# Altium project Serial Power Supply.PrjPcb (part 1 of 2)
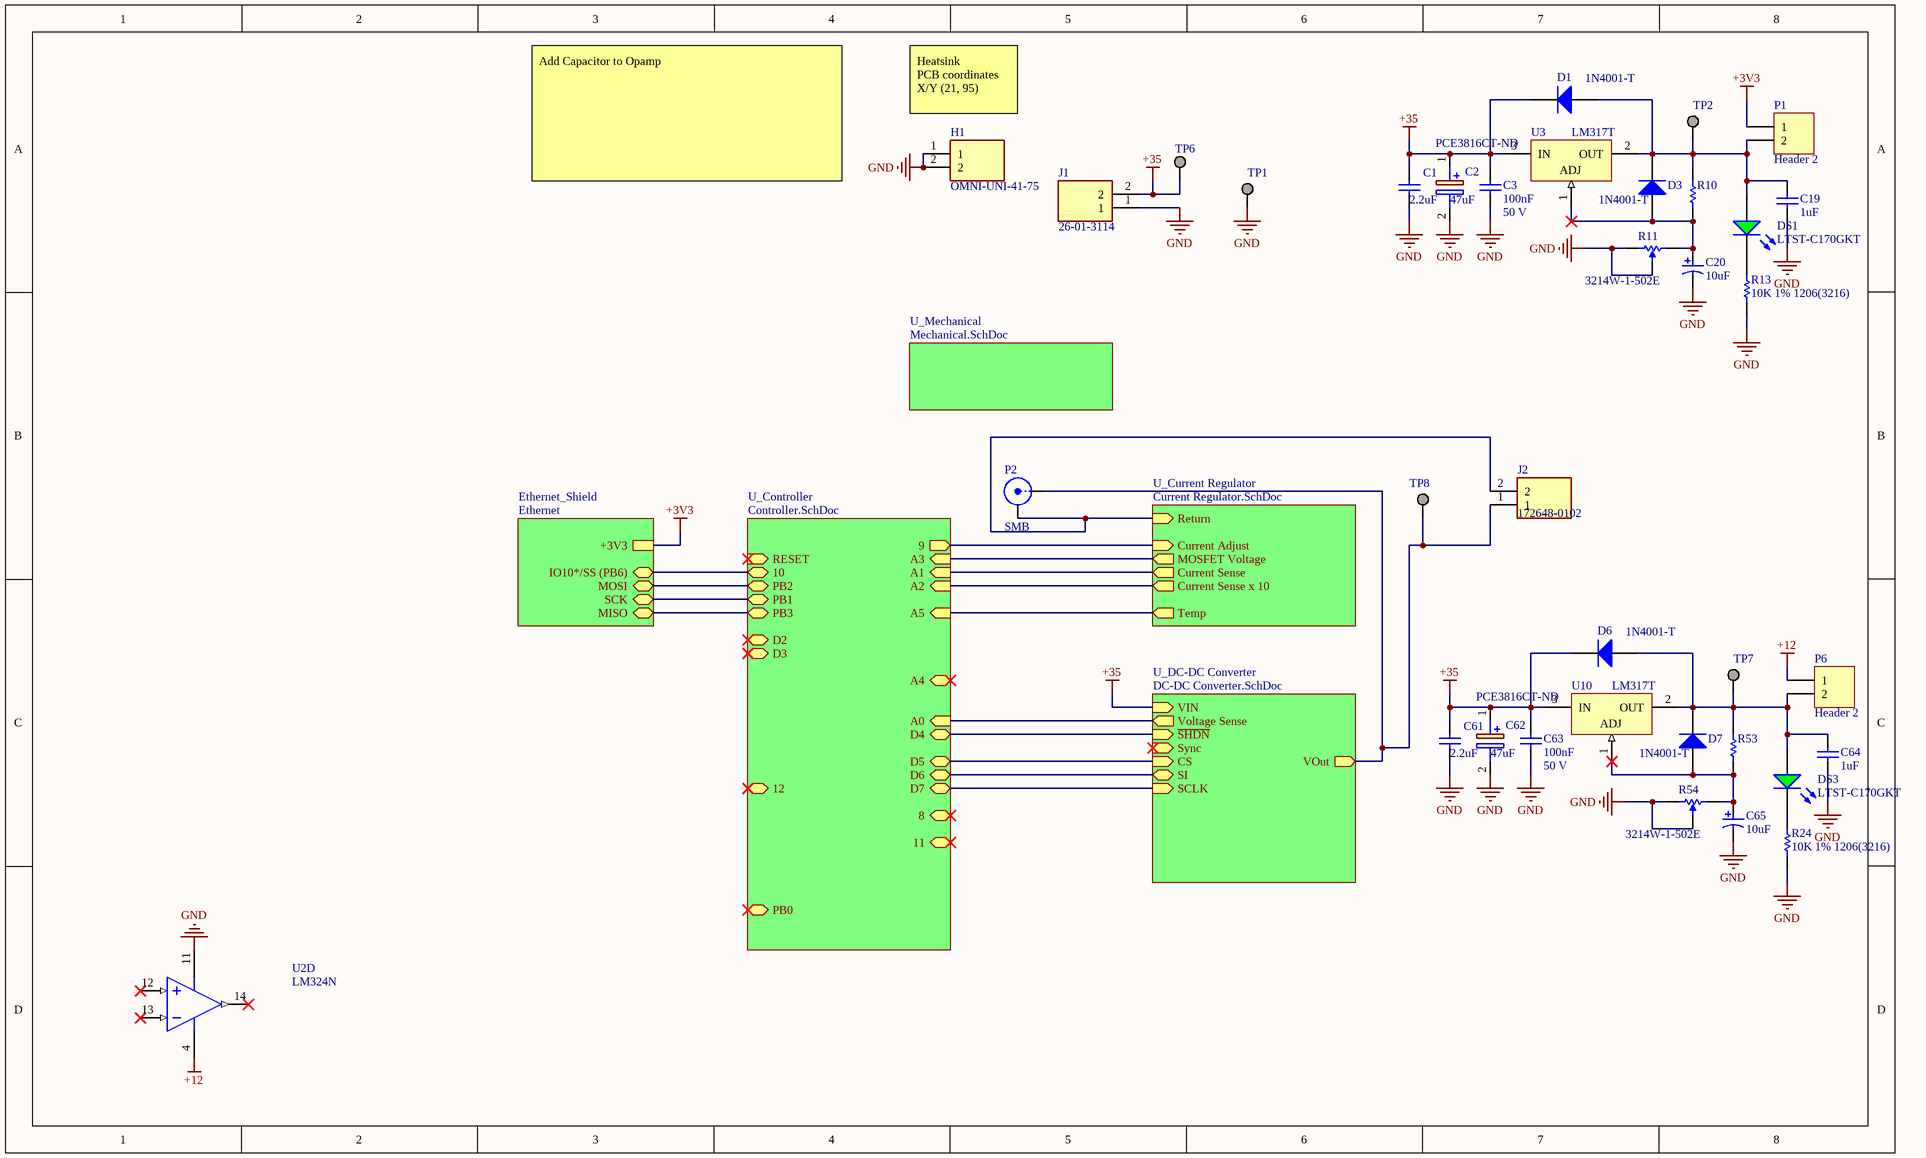
[diagram p0: Serial Power Supply - Main.SchDoc]
CERNProject: CERNProject; EDHNumber: EDHNumber; Group: PH-ADE-ID; ProjectAddress1: CH-1211 Genève 23 - Switzerland; ProjectOrganization: European Organization for Nuclear Research; ProjectTitle: ProjectTitle
6 sheets, 185 parts. Net scope: hierarchical (ports join the sheet entries above them; power ports are global).
Board file: Serial Power Supply.PcbDoc
Sheets:
  Serial Power Supply - Main.SchDoc
    U_DC-DC Converter = DC-DC Converter.SchDoc
    U_Controller = Controller.SchDoc
    U_Current Regulator = Current Regulator.SchDoc
    U_Mechanical = Mechanical.SchDoc
    Ethernet_Shield = Ethernet.SchDoc

## Sheet Serial Power Supply - Main.SchDoc
size Legal

### Parts
C1  value 2.2uF  [CAPC1812(4532)280_L]  (hidden comment: CAP 2.2uF 100V 1812(4532))
C2  47uF  Supplier Part Number 1: PCE3816CT-ND  [CAPAE660X800N]
C3  value 100nF  Rated Voltage: 50 V  [CAPC1206(3216)100_L]  (hidden comment: CAP 100nF 50V 1206(3216))
C19  1uF  [CAPC3216X180X55LL15T30]
C20  10uF  [PNSC-FK-V-D_V]
C61  value 2.2uF  [CAPC1812(4532)280_L]  (hidden comment: CAP 2.2uF 100V 1812(4532))
C62  47uF  Supplier Part Number 1: PCE3816CT-ND  [CAPAE660X800N]
C63  value 100nF  Rated Voltage: 50 V  [CAPC1206(3216)100_L]  (hidden comment: CAP 100nF 50V 1206(3216))
C64  1uF  [CAPC3216X180X55LL15T30]
C65  10uF  [PNSC-FK-V-D_V]
D1  1N4001-T  [DIOD-DO-41-P-2_V]
D3  1N4001-T  [DIOD-DO-41-P-2_V]
D6  1N4001-T  [DIOD-DO-41-P-2_V]
D7  1N4001-T  [DIOD-DO-41-P-2_V]
DS1  LTST-C170GKT  [LTST-C170GKT_V]
DS3  LTST-C170GKT  [LTST-C170GKT_V]
H1  OMNI-UNI-41-75  [OMNIUNI4175]
J1  26-01-3114  [0026013114]
J2  172648-0102  [1726480102]
P1  Header 2  [HDR1X2]
P2  SMB  [SMB_V-RJ45]
P6  Header 2  [HDR1X2]
R10  ERA8AEB471V  [RESC3216X70X50LL20T25]  (value not drawn)
R11  3214W-1-502E  [BOUR-3214W_V]
R13  10K 1% 1206(3216)  [RESC1206(3216)_L]
R24  10K 1% 1206(3216)  [RESC1206(3216)_L]
R53  ERA8AEB471V  [RESC3216X70X50LL20T25]  (value not drawn)
R54  3214W-1-502E  [BOUR-3214W_V]
TP1  GND  [KSTN-1502-2]  (value not drawn)
TP2  3V3  [KSTN-1502-2]  (value not drawn)
TP6  +20V  [KSTN-1502-2]  (value not drawn)
TP7  12V  [KSTN-1502-2]  (value not drawn)
TP8  +20V  [KSTN-1502-2]  (value not drawn)
U2  LM324N  [N14A]  (part D of 4)
U3  LM317T  [TO-220]
U10  LM317T  [TO-220]

### Sub-sheets
Ethernet_Shield = Ethernet: +3V3, IO10*/SS (PB6) (bidir), MOSI (bidir), SCK (bidir), MISO (bidir)
U_Controller = Controller.SchDoc: PB3 (bidir), PB2 (bidir), PB1 (bidir), PB0 (bidir), RESET (in), D2 (bidir), A0 (in), 9 (out), D4 (bidir), A5 (in), 10 (bidir), A1 (in), D6 (bidir), A3 (in), A2 (in), 11 (bidir), 8 (bidir), 12 (bidir), D3 (bidir), A4 (bidir), D7 (bidir), D5 (bidir)
U_Current Regulator = Current Regulator.SchDoc: Return (in), Current Adjust (in), Current Sense x 10 (out), Current Sense (out), MOSFET Voltage (out), Temp (out)
U_DC-DC Converter = DC-DC Converter.SchDoc: Sync (in), VIN (in), ~{SHDN} (in), VOut (out), CS (in), Voltage Sense (out), SCLK (in), SI (bidir)
U_Mechanical = Mechanical.SchDoc: no entries

### Nets
+3V3: P1.1 ; sheet Ethernet_Shield/+3V3
+12: P6.1 U2.4(V+)
+35: C1.2 C2.1(+) C3.1 C61.2 C62.1(+) C63.1 D1.2(K) D6.2(K) J1.2 TP6.1 U3.3(IN) U10.3(IN) ; sheet U_DC-DC Converter/VIN
GND: C1.1 C2.2(-) C3.2 C19.1 C20.2 C61.1 C62.2(-) C63.2 C64.1 C65.2 H1.1 H1.2 J1.1 R11.1 R11.2 R13.1 R24.1 R54.1 R54.2 TP1.1 U2.11(GND)
9: sheet U_Controller/9, sheet U_Current Regulator/Current Adjust
10: sheet U_Controller/10, sheet Ethernet_Shield/IO10*/SS (PB6)
A0: sheet U_DC-DC Converter/Voltage Sense, sheet U_Controller/A0
A1: sheet U_Controller/A1, sheet U_Current Regulator/Current Sense
A2: sheet U_Controller/A2, sheet U_Current Regulator/Current Sense x 10
A3: sheet U_Controller/A3, sheet U_Current Regulator/MOSFET Voltage
A5: sheet U_Controller/A5, sheet U_Current Regulator/Temp
CS: sheet U_DC-DC Converter/CS, sheet U_Controller/D5
D4: sheet U_DC-DC Converter/~{SHDN}, sheet U_Controller/D4
D6: sheet U_DC-DC Converter/SI, sheet U_Controller/D6
D7: sheet U_DC-DC Converter/SCLK, sheet U_Controller/D7
MISO: sheet U_Controller/PB3, sheet Ethernet_Shield/MISO
MOSI: sheet U_Controller/PB2, sheet Ethernet_Shield/MOSI
PB1: sheet U_Controller/PB1, sheet Ethernet_Shield/SCK
Return: J2.2 P2.2(Y) ; sheet U_Current Regulator/Return
VOut: J2.1 P2.1(X) TP8.1 ; sheet U_DC-DC Converter/VOut
NetC19_2: C19.2 D1.1(A) D3.2(K) DS1.1(A) P1.2 R10.2 TP2.1 U3.2(OUT)
NetC20_1: C20.1 D3.1(A) R10.1 R11.3 U3.1(ADJ)
NetC64_2: C64.2 D6.1(A) D7.2(K) DS3.1(A) P6.2 R53.2 TP7.1 U10.2(OUT)
NetC65_1: C65.1 D7.1(A) R53.1 R54.3 U10.1(ADJ)
NetDS1_2: DS1.2(K) R13.2
NetDS3_2: DS3.2(K) R24.2

Not connected (* = marked no-connect by the designer): U2 12(IN4+)* 13(IN4-)* 14(OUT4)*

### Notes on the sheet
- (near H1) Heatsink
  PCB coordinates X/Y (21, 95)
- Add Capacitor to Opamp
- Title
- Size:
- Date:
- Legal
- Number:
- Time:
- Revision:
- Sheet
- of
- File:

### Library data of the parts
C1 C61 = CMP-1040-01635-1: CAP 2.2uF 100V ±10% 1812 (4532 Metric) Thickness 2.8mm SMD; Case-Metric: 4532; Case-EIA: 1812; Tolerance: Â±10%; Rated Voltage: 100 V; Max Thickness: 2.8 mm; Technology: SMT; Supplier 1: Digi-Key; Supplier Part Number 1: 445-4510-2-ND
C2 C62 = EEE-FK1H470XP: Capacitor Polarised / 47uF 50V / EEE-FK1H470XP; Manufacturer_Name: Panasonic; Allied_Number: 70258115; Datasheet Link: https://industrial.panasonic.com/cdbs/www-data/pdf/RDE0000/ABA0000C1181.pdf; Height: 8mm; Manufacturer_Part_Number: EEE-FK1H470XP; Mouser Part Number: 667-EEE-FK1H470XP; Mouser Price/Stock: https://www.mouser.co.uk/ProductDetail/Panasonic/EEE-FK1H470XP?qs=qE6bgDGEOCtuVppQsylaxg%3D%3D; Allied Price/Stock: https://www.alliedelec.com/panasonic-eee-fk1h470xp/70258115/; Supplier 1: Digi-Key
C3 C63 = CMP-1037-04202-1: CAP 100nF 50V ±10% 1206 (3216 Metric) Thickness 1mm SMD; Case-Metric: 3216; Tolerance: Â±10%; Case-EIA: 1206; Technology: SMT; Max Thickness: 1 mm
C19 C64 = CMP-2000-06418-1: Chip Capacitor, 1 uF, +/- 10%, 100 V, -55 to 125 degC, 1206 (3216 Metric), RoHS, Tape and Reel / HMK316B7105KL-T; PCN Part Number: X5R,X7RDielectrics23/Jan/2008; Manufacturer: Taiyo Yuden; Other Names: 587-1777-1; Online Catalog: MSeries; Kits: 587-1794-KIT-ND-KITCAPCERAMICHICAPMLCCSMD; Temperature Coefficient: X7R; Voltage - Rated: 100V; Catalog Drawings: xMKSeries_1206_1.6; Capacitance: 1µF; Standard Package: 1; Manufacturer URL: http://www.t-yuden.com/; Mounting Technology: SurfaceMount; Height - Seated (Max): -; Lead Style: -; Mounting Type: SurfaceMount,MLCC; Thickness (Max): 0.071"(1.80mm); Applications: GeneralPurpose; Lead Spacing: -; Operating Temperature: -55°C~125°C; Size / Dimension: 0.126"Lx0.063"W(3.20mmx1.60mm); Features: HighVoltage; Ratings: -; Category: Capacitors; Datasheet Version: 09/2015; Package Description: 2-Pin Surface Mount Device, Body 3.2 x1.6 mm; Tolerance: ±10%; Family: CeramicCapacitors; Package Reference: 1206; Packaging: CutTape(CT); Datasheet URL: http://www.yuden.co.jp/productdata/catalog/en/mlcc_all_e.pdf; Package / Case: 1206(3216Metric); Series: M
C20 C65 = CMP-2000-06207-1: Aluminum Electrolytic Capacitor, 10 uF, +/- 20%, 50 V, 2-Pin SMD (Size Code D), -55 to 105 degC, RoHS, Tape and Reel / EEEFK1H100P; Manufacturer: Panasonic; Lifetime@Temperature: 2000Hrs@105°C; Type: Can; Rated Voltage: 50V; Ripple Current: 165mA; Impedance: 0.88O; Capacitance: 10µF; Manufacturer URL: http://www.panasonic.com/; Mounting Technology: SurfaceMount; Datasheet URL: http://industrial.panasonic.com/cdbs/www-data/pdf/RDE0000/ABA0000C1181.pdf; Package Reference: FK-V-D; Series: FK; Operating Temp Range: -55to+105°C; Operating Temp-Max: 105°C; Datasheet Version: 03/2016; Package URL: http://industrial.panasonic.com/cdbs/www-data/pdf/RDE0000/DME0000COL48.pdf; Case Size/Dimension: Ø6.3x5.8mm; Package Description: 2-Pin Electrolytic Aluminum Capacitor, Body 6.6 x 6.6 mm
D1 D3 D6 D7 = CMP-0639-00006-2: 1.0 A Rectifier, 15 pF, 50 V, -65 to 150 degC, 2-Pin DO-41 Plastic, RoHS, Tape and Reel; Manufacturer: Diodes Inc; VF (V): 1; CT (pF): 15; Max. IR (uA): 5; VRRM (V): 50; Max. IFSM (A): 30; RoHS: TRUE; Mounting Technology: Through Hole; PartNumber: 1N4001-T; ComponentLink2Description: Datasheet; DatasheetVersion: Rev. 8-2; Operating Temperature Range (degC): -65 to 150; Packing: Tape and Reel; PackageReference: DO-41-P-2; ComponentLink1URL: http://diodes.com/; PackageDescription: 2-Pin Axial Lead, Body 4.635 x 2.36 mm, Lead Spread 25.4 mm; ComponentLink2URL: http://diodes.com/datasheets/ds28002.pdf; Max. Average Rectified Current IO (A): 1; ComponentLink1Description: Manufacturer URL
DS1 DS3 = CMP-1674-00002-5: LED Uni-Color Green, 100 mW, 120 mA, -55 to 85 degC, 2-Pin SMD, RoHS, Tape and Reel; Manufacturer: Lite-On; ComponentLink1URL: http://www.us.liteon.com/; Height: 1.1 mm; PackageDescription: 2-Pin Surface Mount Device, Body 2 x 1.25 mm; RoHSCompliant: true; Package Quantity: 1; Packaging: Tape and Reel; Mount: Surface Mount; Min Operating Temperature: -55 degC; DatasheetVersion: 03/2003; Max Operating Temperature: 85 degC; ComponentLink1Description: Manufacturer URL; Pins: 2; Mounting Technology: Surface Mount; Length: 2 mm; Colour: Green; PackageReference: C170GKT; ComponentLink2URL: http://media.digikey.com/pdf/Data%20Sheets/Lite-On%20PDFs/LTST-C170GKT.pdf; ComponentLink2Description: Datasheet
H1 = OMNI-UNI-41-75: Hardware; Manufacturer_Name: Wakefield-Vette; Datasheet Link: https://componentsearchengine.com/Datasheets/1/OMNI-UNI-41-75.pdf; Height: 63mm; Manufacturer_Part_Number: OMNI-UNI-41-75; Mouser Part Number: 567-OMNI-UNI-41-75; Mouser Price/Stock: https://www.mouser.co.uk/ProductDetail/Wakefield-Vette/OMNI-UNI-41-75?qs=u4fy%2FsgLU9MMQhJzv7kr6g%3D%3D
J1 = 26-01-3114: Connector; Manufacturer_Name: Molex; Datasheet Link: http://www.molex.com/webdocs/datasheets/pdf/en-us//0026013114_PCB_HEADERS.pdf; Height: 9mm; Manufacturer_Part_Number: 26-01-3114; Arrow Part Number: 26-01-3114; Mouser Part Number: 538-26-01-3114; Mouser Price/Stock: https://www.mouser.co.uk/ProductDetail/Molex/26-01-3114?qs=ZhwKFWhxrSEC8%252Bv2mQsO9A%3D%3D
J2 = 172648-0102: Connector; Manufacturer_Name: Molex; Datasheet Link: https://www.molex.com/pdm_docs/sd/1726480102_sd.pdf; Height: 5.4mm; Manufacturer_Part_Number: 172648-0102; Arrow Part Number: 172648-0102; Mouser Part Number: 538-172648-0102; Mouser Price/Stock: https://www.mouser.co.uk/ProductDetail/Molex/172648-0102?qs=OAhjpuo3Vu6rwl2O%2FXoypw%3D%3D
P1 P6 = Header 2: Header, 2-Pin; LatestRevisionDate: 17-Jul-2002; LatestRevisionNote: Re-released for DXP Platform.; Publisher: Altium Limited
P2 = SMB: SMB Straight Connector; LatestRevisionDate: 17-Jul-2002; LatestRevisionNote: Re-released for DXP Platform.; Publisher: Altium Limited
R10 R53 = CMP-2003-04470-1: 470 ohm; Manufacturer: Panasonic; Part Number: ERA8AEB471V
R11 R54 = CMP-2000-05579-1: 3214 - 5-Turn Trimpot(R) Trimming Potentiometer, 5 KOhm, +/- 10%, 0.25 W, -65 to 150 degC, RoHS, Tape and Reel; Manufacturer: Bourns; Temperature Coefficient: ±100ppm/°C; Power Rating: 250mW; No. of Turns: 5; Track Resistance: 5kohm; SVHC: NoSVHC(16-Jun-2014); Potentiometer Mounting: SMD; Manufacturer URL: http://www.bourns.com/; Resistance Tolerance: ±10%; Datasheet URL: http://www.bourns.com/docs/Product-Datasheets/3214.pdf; ROHS COMPLIANT: Yes; Mounting Technology: SurfaceMount; Datasheet Version: 05/2016; Package Reference: 3214W; Package Description: 3-Pin Surface Mount Device, Body 3.5 x 4.8 mm, Pitch 1.25 mm
R13 R24 = CMP-1014-00623-1: 10K 0.25W 1% 1206 (3216 Metric)  SMD; Case-Metric: 3216; Value: 10000.00 Ohm; Case-EIA: 1206; Power: 0.25 W; Technology: SMT; Tolerance: 1 %
TP1 TP2 TP6-TP8 = CMP-1672-00001-4: Terminal DBL Turret, Through Hole, RoHS; Contact Finish: Tin; Lead Pitch: 0.218 inch; PackageReference: 1502-2; Mount: Through Hole; Pins: 50; DatasheetVersion: Rev. A, 02/2008; RoHSCompliant: true; REACH SVHC: No SVHC; Contact Material: Brass; Length: 2.77 mm; PackageDescription: 1-Pin Through Hole Device, Dia 3.18 mm; Package Quantity: 1; Mounting Technology: Through Hole; Supplier 1: Mouser; Supplier Part Number 1: 575-2501200800000
U2 = CMP-0055-00082-1: Low Power Quad Operational Amplifier, 14-pin MDIP; Manufacturer: National Semiconductor; PackageTopMarking: NSUZXYYTTE#*LM324N; PowerWise: N; CompType: Amplifiers; PinCount: 14; PackageVersion: revG, May-2006; PackageReference: N14A; Code_JEDEC: MS-001-AA; PackageDescription: MDIP, .750 x .250 x.130in, 14 Lead, .100in Pitch; RoHS: N; DatasheetVersion: Aug-2000
U3 U10 = CMP-0244-00444-1: 1.5A, 1.2V to 37V Adjustable Voltage Regulator, 3-Pin TO-220; PackageVersion: 2011; ComponentLink1URL: http://www.st.com; ComponentLink2URL: http://www.st.com/internet/com/TECHNICAL_RESOURCES/TECHNICAL_LITERATURE/DATASHEET/CD00000455.pdf; PackageDescription: TO, Thru-Hole, Vertical, Heatsink Mounted; 3 In-Line Leads; Pitch 2.54 mm; PackageReference: TO-220; ComponentLink1Description: Manufacturer URL; ComponentLink3URL: http://www.st.com/internet/com/TECHNICAL_RESOURCES/TECHNICAL_LITERATURE/PACKAGE_INFORMATION/CD00004649.pdf; DatasheetVersion: 1/11/2011; ComponentLink2Description: Datasheet; ComponentLink3Description: Package Specification

## Sheet DC-DC Converter.SchDoc
size Legal
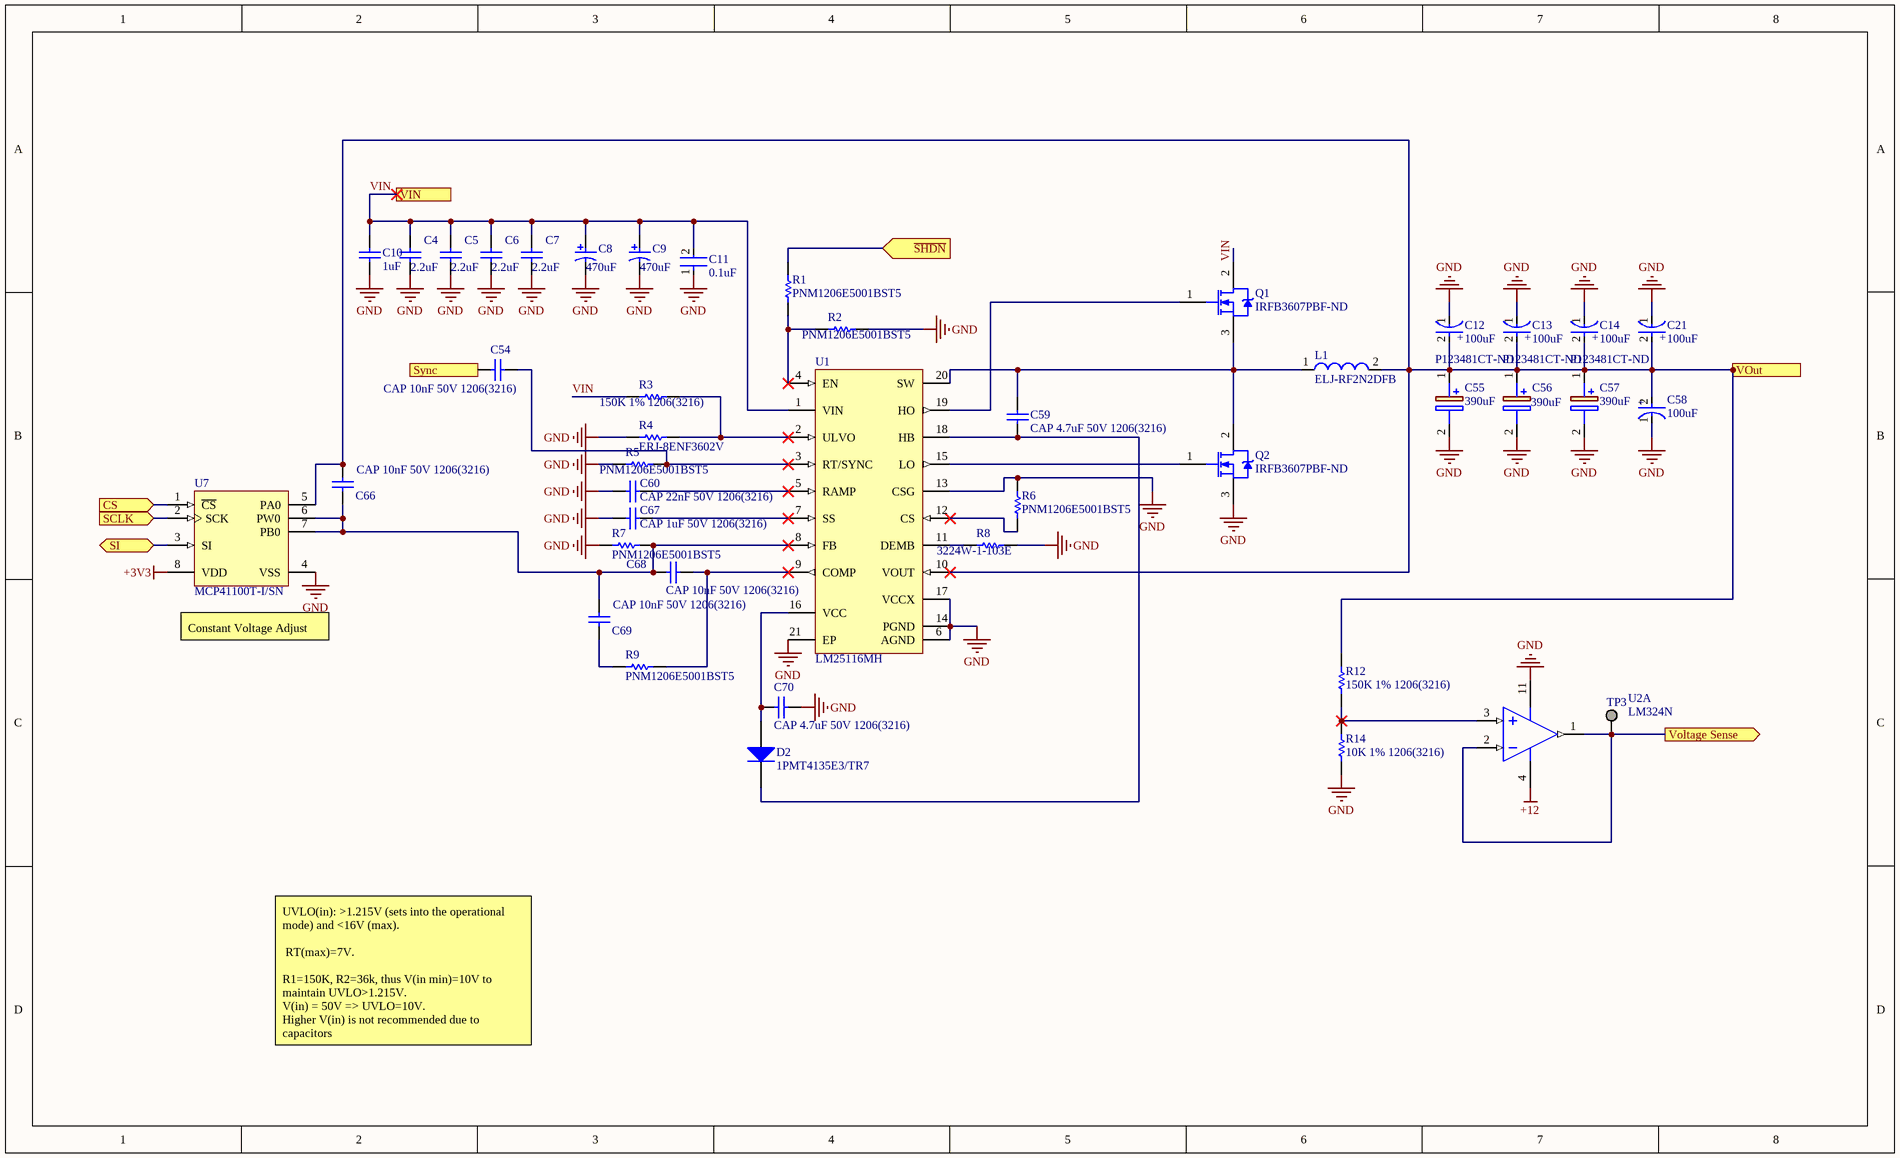
[diagram p1: DC-DC Converter.SchDoc]

### Parts
C4  value 2.2uF  [CAPC1812(4532)280_L]  (hidden comment: CAP 2.2uF 100V 1812(4532))
C5  value 2.2uF  [CAPC1812(4532)280_L]  (hidden comment: CAP 2.2uF 100V 1812(4532))
C6  value 2.2uF  [CAPC1812(4532)280_L]  (hidden comment: CAP 2.2uF 100V 1812(4532))
C7  value 2.2uF  [CAPC1812(4532)280_L]  (hidden comment: CAP 2.2uF 100V 1812(4532))
C8  470uF  [PNSC-EEV-FK1J471M_L]
C9  470uF  [PNSC-EEV-FK1J471M_L]
C10  1uF  [CAPC3216X180X55LL15T30]
C11  0.1uF  [FP-C1206C-EB-IPC_B]
C12  100uF  [FP-EEE-FK1H101P-MFG]
C13  100uF  [FP-EEE-FK1H101P-MFG]
C14  100uF  [FP-EEE-FK1H101P-MFG]
C21  100uF  [FP-EEE-FK1H101P-MFG]
C54  CAP 10nF 50V 1206(3216)  [CAPC1206(3216)150_L]
C55  390uF  Supplier Part Number 1: P123481CT-ND  [CAPAE1700X1700N]
C56  390uF  Supplier Part Number 1: P123481CT-ND  [CAPAE1700X1700N]
C57  390uF  Supplier Part Number 1: P123481CT-ND  [CAPAE1700X1700N]
C58  100uF  [FP-EEE-FK1H101P-MFG]
C59  CAP 4.7uF 50V 1206(3216)  [MURA-1206_H_1.8_L]
C60  CAP 22nF 50V 1206(3216)  [CAPC1206(3216)170_L]
C66  CAP 10nF 50V 1206(3216)  [CAPC1206(3216)150_L]
C67  CAP 1uF 50V 1206(3216)  [CAPC3216X180X20LL20]
C68  CAP 10nF 50V 1206(3216)  [CAPC1206(3216)150_L]
C69  CAP 10nF 50V 1206(3216)  [CAPC1206(3216)150_L]
C70  CAP 4.7uF 50V 1206(3216)  [MURA-1206_H_1.8_M]
D2  1PMT4135E3/TR7  [1PMT4135E]
L1  ELJ-RF2N2DFB  [WE-HCI-1890]
Q1  Supplier Part Number 1: IRFB3607PBF-ND  [INTR-TO-220AB-3_A]  (hidden comment: MOSFET for DCDC)
Q2  Supplier Part Number 1: IRFB3607PBF-ND  [INTR-TO-220AB-3_A]  (hidden comment: MOSFET for DCDC)
R1  PNM1206E5001BST5  [RESC1206(3216)_L]
R2  PNM1206E5001BST5  [RESC3216X60X45LL10T20]
R3  150K 1% 1206(3216)  [RESC1206(3216)_L]
R4  ERJ-8ENF3602V  [RESC3216X70X50NL05T20]
R5  PNM1206E5001BST5  [RESC3216X60X45LL10T20]
R6  PNM1206E5001BST5  [RESC3216X89X51LL25T25]
R7  PNM1206E5001BST5  [RESC3216X60X45LL10T20]
R8  3224W-1-103E  [RESC3216X60X45LL10T20]
R9  PNM1206E5001BST5  [RESC3216X60X45LL10T20]
R12  150K 1% 1206(3216)  [RESC1206(3216)_L]
R14  10K 1% 1206(3216)  [RESC1206(3216)_L]
TP3  VS  [KSTN-1502-2]  (value not drawn)
U1  LM25116MH  [PWP0020A_L]
U2  LM324N  [N14A]  (part A of 4)
U7  MCP41100T-I/SN  [SOIC-SN8_L]

### Ports
CS (in), SCLK (in), SI (bidir), Sync (in), VIN, Voltage Sense (out), VOut (out), ~{SHDN} (in)

### Nets
+3V3: U7.8(VDD)
+12: U2.4(V+)
GND: C4.1 C5.1 C6.1 C7.1 C8.2 C9.2 C10.1 C11.1 C12.1(C) C13.1(C) C14.1(C) C21.1(C) C55.2(-) C56.2(-) C57.2(-) C58.1(C) C60.1 C67.1 C70.2 Q2.3(S) R2.1 R4.1 R5.1 R6.2 R7.1 R8.2 R14.2 U1.6(AGND) U1.13(CSG) U1.14(PGND) U1.17(VCCX) U1.21(EP) U2.11(GND) U7.4(VSS)
VIN: C4.2 C5.2 C6.2 C7.2 C8.1 C9.1 C10.2 C11.2 Q1.2(D) R3.2 U1.1(VIN) ; port VIN  [project net +35]
A0: TP3.1 U2.1(OUT1) U2.2(IN1-) ; port Voltage Sense
CS: U7.1(~{CS}) ; port CS
D4: R1.2 ; port ~{SHDN}
D6: U7.3(SI) ; port SI
D7: U7.2(SCK) ; port SCLK
Sync: C54.2 ; port Sync
VOut: C12.2(A) C13.2(A) C14.2(A) C21.2(A) C55.1(+) C56.1(+) C57.1(+) C58.2(A) C66.1 L1.2 R12.2 U1.10(VOUT) U7.5(PA0) ; port VOut
NetC54_1: C54.1 R5.2 U1.3(RT/SYNC)
NetC59_1: C59.1 L1.1 Q1.3(S) Q2.2(D) U1.20(SW)
NetC59_2: C59.2 D2.2(K) U1.18(HB)
NetC60_2: C60.2 U1.5(RAMP)
NetC66_2: C66.2 C68.1 C69.1 R7.2 U1.8(FB) U7.6(PW0) U7.7(PB0)
NetC67_2: C67.2 U1.7(SS)
NetC68_2: C68.2 R9.2 U1.9(COMP)
NetC69_2: C69.2 R9.1
NetC70_1: C70.1 D2.1(A) U1.16(VCC)
NetQ1_1: Q1.1(G) U1.19(HO)
NetQ2_1: Q2.1(G) U1.15(LO)
NetR1_1: R1.1 R2.2 U1.4(EN)
NetR3_1: R3.1 R4.2 U1.2(ULVO)
NetR6_1: R6.1 U1.12(CS)
NetR8_1: R8.1 U1.11(DEMB)
NetR12_1: R12.1 R14.1 U2.3(IN1+)

### Notes on the sheet
- Text
- (near U7) Constant Voltage Adjust
- UVLO(in): >1.215V (sets into the operational mode) and <16V (max).
  RT(max)=7V.
  R1=150K, R2=36k, thus V(in min)=10V to maintain UVLO>1.215V.
  V(in) = 50V => UVLO=10V.
  Higher V(in) is not recommended due to capacitors
- (in symbol CMP-05427-000005-1) +

### Library data of the parts
C4-C7 = CMP-1040-01635-1: as C1 on sheet Serial Power Supply - Main; Rated Voltage: 100 V; Max Thickness: 2.8 mm; Technology: SMT; Supplier 1: Digi-Key; Supplier Part Number 1: 445-4510-2-ND
C8 C9 = CMP-1665-00018-3: Aluminum Electrolytic Capacitor (SMD Type), 470 uF, 63 V, -55 to 105 degC, 2-Pin CAPAE, RoHS, Tape and Reel; Manufacturer: Panasonic; Voltage Rating: 63 V; Mounting Technology: Surface Mount; Length: 17 mm; PackageDescription: 2-Pin Electrolytic Aluminum Capacitor, Body 17 x 17 mm; Package Quantity: 125; ComponentLink1URL: http://www.panasonic.com/; RoHSCompliant: true; REACH SVHC: Unknown; Pins: 2; DatasheetVersion: 03/2016; PackageReference: EEV-FK1J471M; Min Operating Temperature: -55 degC; ComponentLink2URL: https://industrial.panasonic.com/cdbs/www-data/pdf/RDE0000/ABA0000C1181.pdf; Height: 16.5 mm; ComponentLink2Description: Datasheet; ComponentLink1Description: Manufacturer URL; Mount: Surface Mount; Packaging: Tape and Reel; Max Operating Temperature: 105 degC
C10 = CMP-2000-06418-1: as C19 on sheet Serial Power Supply - Main; Standard Package: 1; Manufacturer URL: http://www.t-yuden.com/; Mounting Technology: SurfaceMount; Height - Seated (Max): -; Lead Style: -; Mounting Type: SurfaceMount,MLCC; Thickness (Max): 0.071"(1.80mm); Applications: GeneralPurpose; Lead Spacing: -; Operating Temperature: -55°C~125°C; Size / Dimension: 0.126"Lx0.063"W(3.20mmx1.60mm); Features: HighVoltage; Ratings: -; Category: Capacitors; Datasheet Version: 09/2015; Package Description: 2-Pin Surface Mount Device, Body 3.2 x1.6 mm; Tolerance: ±10%; Family: CeramicCapacitors; Package Reference: 1206; Packaging: CutTape(CT); Datasheet URL: http://www.yuden.co.jp/productdata/catalog/en/mlcc_all_e.pdf; Package / Case: 1206(3216Metric); Series: M
C11 = CMP-03020-006091-1: CAP CER 0.1UF 50V U2J 1206; Manufacturer: KEMET; Manufacturer Part Number: C1206C104J5JACTU; Temperature Coefficient: 15%; Tolerance: 0.05; Value: 0.10 μF; Material: Ceramic; Automotive Grade: Grade 0; Height: 0.88mm; Category: Cap; Temperature Range Low: -55°C; ComponentLink2Description: Datasheet; Ipc Land Pattern Name: CAPC320160X78; Device Class L1: Passive Components; Lead Free: Yes; Package: C1206C-EB; Device Class L3: Ceramic Capacitors; Temperature Characteristic: U2J; Automotive: Yes; Temperature Range High: +150°C; ComponentLink2URL: https://content.kemet.com/datasheets/KEM_C1007_X8R_ULTRA_150C_SMD.pdf; Digikey Description: CAP CER 0.1UF 50V U2J 1206; RoHS: TRUE; Capacitance: 0.10 μF; Device Class L2: Capacitors; Octopart: https://octopart.com/c1206c104j5jactu-kemet-74675307; Voltage Rating: 50 V; Temperature: -55°C to +150°C
C12-C14 C21 C58 = CMP-05427-000005-1: CAP ALUM 100UF 20% 50V SMD / EEE-FK1H101P; Manufacturer: Panasonic Electronic Components; Automotive Grade: Grade 2; Dissipation Factor: 10%; Life: 2000Hours; Ripple Current: 350mA; Material: Aluminum; Esr: 0.34Ω; Leakage Current: 50uA; Tolerance: 20%; Package: 0; ComponentLink2URL: https://industrial.panasonic.com/cdbs/www-data/pdf/RDE0000/ABA0000C1181.pdf; Manufacturer Part Number: EEE-FK1H101P; Temperature Range Low: -55°C; Voltage Rating: 50V; ComponentLink2Description: Datasheet; Category: Cap; Digikey Description: CAP ALUM 100UF 20% 50V SMD; Octopart: https://octopart.com/eeefk1h101p-panasonic-4642841; Automotive: Yes; Temperature: -55°C to +105°C; Capacitance: 100uF; Lead Free: Yes; Mouser Description: Cap Aluminum Lytic 100uF 50V 20% (8 X 10.2mm) SMD 350mA 2000h 105C Automotive T/R; Height: 10.5mm; Device Class L3: Aluminum Electrolytic Capacitors; Value: 100uF; Device Class L1: Passive Components; RoHS: TRUE; Device Class L2: Capacitors; Temperature Range High: +105°C
C54 C66 C68 C69 = CMP-1037-03511-1: CAP 10nF 50V ±10% 1206 (3216 Metric) Thickness 1.45mm SMD; Case-Metric: 3216; Tolerance: Â±10%; Case-EIA: 1206; Value: 10nF; Rated Voltage: 50 V; Max Thickness: 1.45 mm; Technology: SMT
C55-C57 = EEE-TP1K391V: 390uF +-20% 80V / Capacitor Polarised / EEE-TP1K391V; Manufacturer_Name: Panasonic; Datasheet Link: https://industrial.panasonic.com/cdbs/www-data/pdf/RDE0000/RDE0000C1255.pdf; Height: 17mm; Manufacturer_Part_Number: EEE-TP1K391V; Mouser Part Number: 667-EEE-TP1K391V; Mouser Price/Stock: https://www.mouser.co.uk/ProductDetail/Panasonic/EEE-TP1K391V?qs=XFmntM7Yc9dUeO1BN5vyvw%3D%3D; Supplier 1: Digi-Key
C59 = CMP-2000-05258-1: CAP, Ceramic, 4.7 uF, 10%, 50 V, 1206, RoHS, Tape and ReelReelGRM31CR71H475KA12L; Manufacturer: Murata; Capacitance: 4700000pF; Dielectric: X7R; Manufacturer URL: http://www.murata.com/; Datasheet URL: https://datasheet.ciiva.com/29201/451984-da-01-en-vs-kondensator-0603-29201725.pdf; Datasheet Version: Dec-10; Case Size/Dimension: 1206; Tolerance (%): ±10%; Rated Voltage: 50V
C60 = CMP-1037-03785-1: CAP 22nF 200V ±10% 1206 (3216 Metric) Thickness 1.7mm SMD; Case-Metric: 3216; Tolerance: Â±10%; Case-EIA: 1206; Value: 22nF; Max Thickness: 1.7 mm; Rated Voltage: 200 V; Technology: SMT
C67 = CMP-2000-06049-1: Chip Capacitor, 1 uF, +/- 10%, 100 V, -55 to 125 degC, 1206 (3216 Metric), RoHS, Tape and Reel; Manufacturer: TDK; PCN Part Number: MLCCPartNumberChange30/Nov/2012; Kits: SAMPLEKIT1008-ND-KITCAPCERMLCC100V-630V; Product Training Modules: SEAT,CCV,andTVCLDesignToolsGuidetoReplacinganElectrolyticCapacitorwithanMLCC; Capacitance: 1µF; Featured Product: C-SeriesMidVoltageMLCCs; Voltage - Rated: 100V; Other Names: 445-4467-1; Catalog Drawings: CSERIES_1206_1.8; Online Catalog: CSeries,MidVoltage; Temperature Coefficient: X7R; Features: -; Family: CeramicCapacitors; Datasheet URL: http://www.farnell.com/datasheets/1484596.pdf; Mounting Technology: SurfaceMount; Mounting Type: SurfaceMount,MLCC; Datasheet Version: 08/2011; Standard Package: 1; Package / Case: 1206(3216Metric); Thickness (Max): 0.051"(1.30mm); Size / Dimension: 0.126"Lx0.063"W(3.20mmx1.60mm); Applications: GeneralPurpose; Package Reference: 1206; Operating Temperature: -55°C~125°C; Packaging: CutTape(CT); Package Description: 2-Pin Surface Mount Device, Body 3.2 x 1.6 mm; Ratings: -; Series: C; Tolerance: ±10%; Manufacturer URL: http://www.tdk.com/; Lead Spacing: -; Height - Seated (Max): -; Package URL: https://product.tdk.com/info/en/documents/chara_sheet/C3216X7R1V106K160AC.pdf; Lead Style: -; Category: Capacitors; RoHS Information: RoHSCertificate-MLCC
C70 = CMP-2000-05258-1: CAP, Ceramic, 4.7 uF, 10%, 50 V, 1206, RoHS, Tape and ReelGRM31CR71H475KA12L; Manufacturer: Murata; Capacitance: 4700000pF; Dielectric: X7R; Manufacturer URL: http://www.murata.com/; Datasheet URL: https://datasheet.ciiva.com/29201/451984-da-01-en-vs-kondensator-0603-29201725.pdf; Datasheet Version: Dec-10; Case Size/Dimension: 1206; Tolerance (%): ±10%; Rated Voltage: 50V
D2 = CMP-2000-05518-2: Surface Mount Fast Switching Diode, -65 to 150 degC, 2-Pin SOD523, RoHS, Tape and Reel; PartNumber: 1N4148WT; Manufacturer: Diodes Inc; Diode Configuration: Single; Number of Elements per Chip: 1; Forward Current: 250mA; Datasheet URL: http://www.diodes.com/_files/datasheets/ds30396.pdf; Mounting Technology: SurfaceMount; Manufacturer URL: http://www.diodes.com/; Package URL: http://www.diodes.com/_files/packages/SOD523.pdf; Pin Count: 2; Package Description: 2-Pin Small Outline Diode, Body 1.2 x 0.8 mm; Package Reference: SOD523-2; Mounting Type: SurfaceMount; Package Type: SOD-523; Datasheet Version: Rev. 16-2, 11/2015
L1 = CMP-0226-00001-1: SMD Flat Wire High Current Inductor WE-HCI, L=10.0 µH; Inductance: 10.0 ÂµH; PackageReference: WE-HCI-1890; ComponentLink1Description: Manufacturer Link; DatasheetVersion: ver 2, Nov-2009; PackageDescription: Inductor, 2-Leads, Body 18.3 x 18.2 mm; ComponentLink2URL: http://www.we-online.de/katalog/media/pdf/74435561100.pdf; PackageVersion: 2009; ComponentLink1URL: http://www.we-online.com; ComponentLink2Description: Datasheet
Q1 Q2 = IRFB3607PBF: INTERNATIONAL RECTIFIER   IRFB3607PBF   MOSFET Transistor, N Channel, 80 A, 75 V, 0.00734 ohm, 10 V, 4 V; Continuous Drain Current (ID): 80A; Gate to Source Voltage (Vgs): 20V; Turn-Off Delay Time: 43ns; Turn-On Delay Time: 16ns; Rise Time: 110ns; Fall Time: 96ns; Drain to Source Voltage (Vdss): 75V; Power Dissipation: 140W; Drain to Source Resistance: 9mR; Input Capacitance: 3.07nF; Threshold Voltage: 4V; Element Configuration: Single; Number of Elements: 1; Recovery Time: 50ns; Supplier 1: Digi-Key; Manufacturer: International Rectifier; Manufacturer Part Number: IRFB3607PBF; Stock 1: 2332; Pricing 1: 1 = 0.85000, 10 = 0.75100, 25 = 0.70520, 100 = 0.51190, 250 = 0.49368, 500 = 0.42770, 1000 = 0.36400, 2500 = 0.34125, 5000 = 0.30713 (USD); RoHS: Yes; Mount: Through Hole; Case/Package: TO-220AB; Number of Pins: 3; Min Operating Temperature: -55°C; Max Operating Temperature: 175°C; Drain to Source Breakdown Voltage: 75V; Max Power Dissipation: 140W; Rds On Max: 9mR; Packaging: Rail/Tube; Package Quantity: 50; Termination: Through Hole; Dual Supply Voltage: 75V; On-State Resistance: 9MR; Nominal Vgs: 4V; Length: 10.66mm; Height: 9.02mm; Width: 4.82mm; Radiation Hardening: No; Lead Free: Lead Free; REACH SVHC: No SVHC; ComponentLink1URL: https://datasheet.ciiva.com/14170/irfs3607pbf-eng-tds-14170693.pdf?src-supplier=Distrelec; ComponentLink1Description: https://datasheet.ciiva.com/14170/irfs3607pbf-eng-tds-14170693.pdf?src-supplier=Distrelec; ComponentLink2URL: https://datasheet.ciiva.com/17315/irfs3607pbf-17315511.pdf?src-supplier=Avnet+Europe; ComponentLink2Description: https://datasheet.ciiva.com/17315/irfs3607pbf-17315511.pdf?src-supplier=Avnet+Europe; ComponentLink3URL: https://datasheet.ciiva.com/6368/irfs3607pbf-6368216.pdf?src-supplier=Digi-Key; ComponentLink3Description: https://datasheet.ciiva.com/6368/irfs3607pbf-6368216.pdf?src-supplier=Digi-Key; ComponentLink4URL: https://datasheet.ciiva.com/7798/irfs3607pbf-7798745.pdf?src-supplier=Element14; ComponentLink4Description: https://datasheet.ciiva.com/7798/irfs3607pbf-7798745.pdf?src-supplier=Element14; ComponentLink5URL: https://datasheet.ciiva.com/16355/irfs3607pbf-16355482.pdf?src-supplier=Future+Electronics; ComponentLink5Description: https://datasheet.ciiva.com/16355/irfs3607pbf-16355482.pdf?src-supplier=Future+Electronics
R1 = CMP-1014-00736-1: 100K 0.25W 1% 1206 (3216 Metric)  SMD; Case-EIA: 1206; Value: 100000.00 Ohm; Case-Metric: 3216; Tolerance: 1 %; Power: 0.25 W; Technology: SMT
R2 = CMP-2003-01906-1: Manufacturer: Vishay Dale; Part Number: CRCW12061M00FKEA
R3 R12 = CMP-1014-00754-1: 150K 0.25W 1% 1206 (3216 Metric)  SMD; Case-EIA: 1206; Value: 150000.00 Ohm; Case-Metric: 3216; Technology: SMT; Power: 0.25 W; Tolerance: 1 %
R4 = CMP-2003-00329-1: Manufacturer: Panasonic; Part Number: ERJ-8ENF3602V
R5 = CMP-2003-01940-1: Manufacturer: Vishay Dale; Part Number: CRCW120620K0FKEA
R6 = CMP-2003-04339-1: Manufacturer: Vishay Dale; Part Number: WSL12064L000FEA
R7 = CMP-2003-02155-1: Part Number: CRCW12063K60FKEA; Manufacturer: Vishay Dale
R8 = CMP-2003-04820-1: Part Number: CRCW1206110KFKEA; Manufacturer: Vishay Dale
R9 = CMP-2003-02122-1: Part Number: CRCW120636K0JNEA; Manufacturer: Vishay Dale
R14 = CMP-1014-00623-1: as R13 on sheet Serial Power Supply - Main; Power: 0.25 W; Technology: SMT; Tolerance: 1 %
TP3 = CMP-1672-00001-4: Terminal DBL Turret, Through Hole, RoHS; Contact Finish: Tin; Lead Pitch: 0.218 inch; PackageReference: 1502-2; Mount: Through Hole; Pins: 50; DatasheetVersion: Rev. A, 02/2008; RoHSCompliant: true; REACH SVHC: No SVHC; Contact Material: Brass; Length: 2.77 mm; PackageDescription: 1-Pin Through Hole Device, Dia 3.18 mm; Package Quantity: 1; Mounting Technology: Through Hole; Supplier 1: Mouser; Supplier Part Number 1: 575-2501200800000
U1 = CMP-0069-01392-3: Wide Range Synchronous Buck Controller, 20-pin TSSOP-EP; Manufacturer: Texas Instruments; CompType: Switcher; PackageTopMarking: NSUZXYTT*LM25116*MH; PowerWise: Y; ComponentLink1Description: Datasheet URL; PackageDescription: Molded TSSOP, Jedec, 6.5 x 4.4 x 0.9mm Body, 20 Lead, 0.65mm Pitch, Exposed Pad; RoHS: N; ComponentLink1URL: http://www.ti.com/general/docs/lit/getliterature.tsp?genericPartNumber=LM25116&fileType=pdf; PackageReference: PWP0020A; Code_JEDEC: MO-153-ACT; PinCount: 20
U2 = CMP-0055-00082-1: as U2 on sheet Serial Power Supply - Main; PinCount: 14; PackageVersion: revG, May-2006; PackageReference: N14A; Code_JEDEC: MS-001-AA; PackageDescription: MDIP, .750 x .250 x.130in, 14 Lead, .100in Pitch; RoHS: N; DatasheetVersion: Aug-2000
U7 = CMP-0188-00044-2: Single/Dual Digital Potentiometer with SPI Interface, 8-Pin SOIC 150mil, Industrial Temperature, Tape and Reel; ComponentLink1URL: http://www.microchip.com/; PackageVersion: revBB, Aug-2009; ComponentLink2URL: http://ww1.microchip.com/downloads/en/DeviceDoc/11195c.pdf; Code_IPC: SOIC127P600-8; PackageReference: SOIC-SN8; RevisionNote: URLs added.; ComponentLink3Description: Package Specification; ComponentLink3URL: http://www.microchip.com/stellent/groups/techpub_sg/documents/packagingspec/en012702.pdf; ComponentLink2Description: Datasheet; DatasheetVersion: Jul-2003; PackageDescription: 8-Lead Plastic Small Outline (SN) - Narrow, 3.90mm Body [SOIC]; Code_JEDEC: MS-012; ComponentLink1Description: Manufacturer URL

## Sheet Controller.SchDoc
size Legal
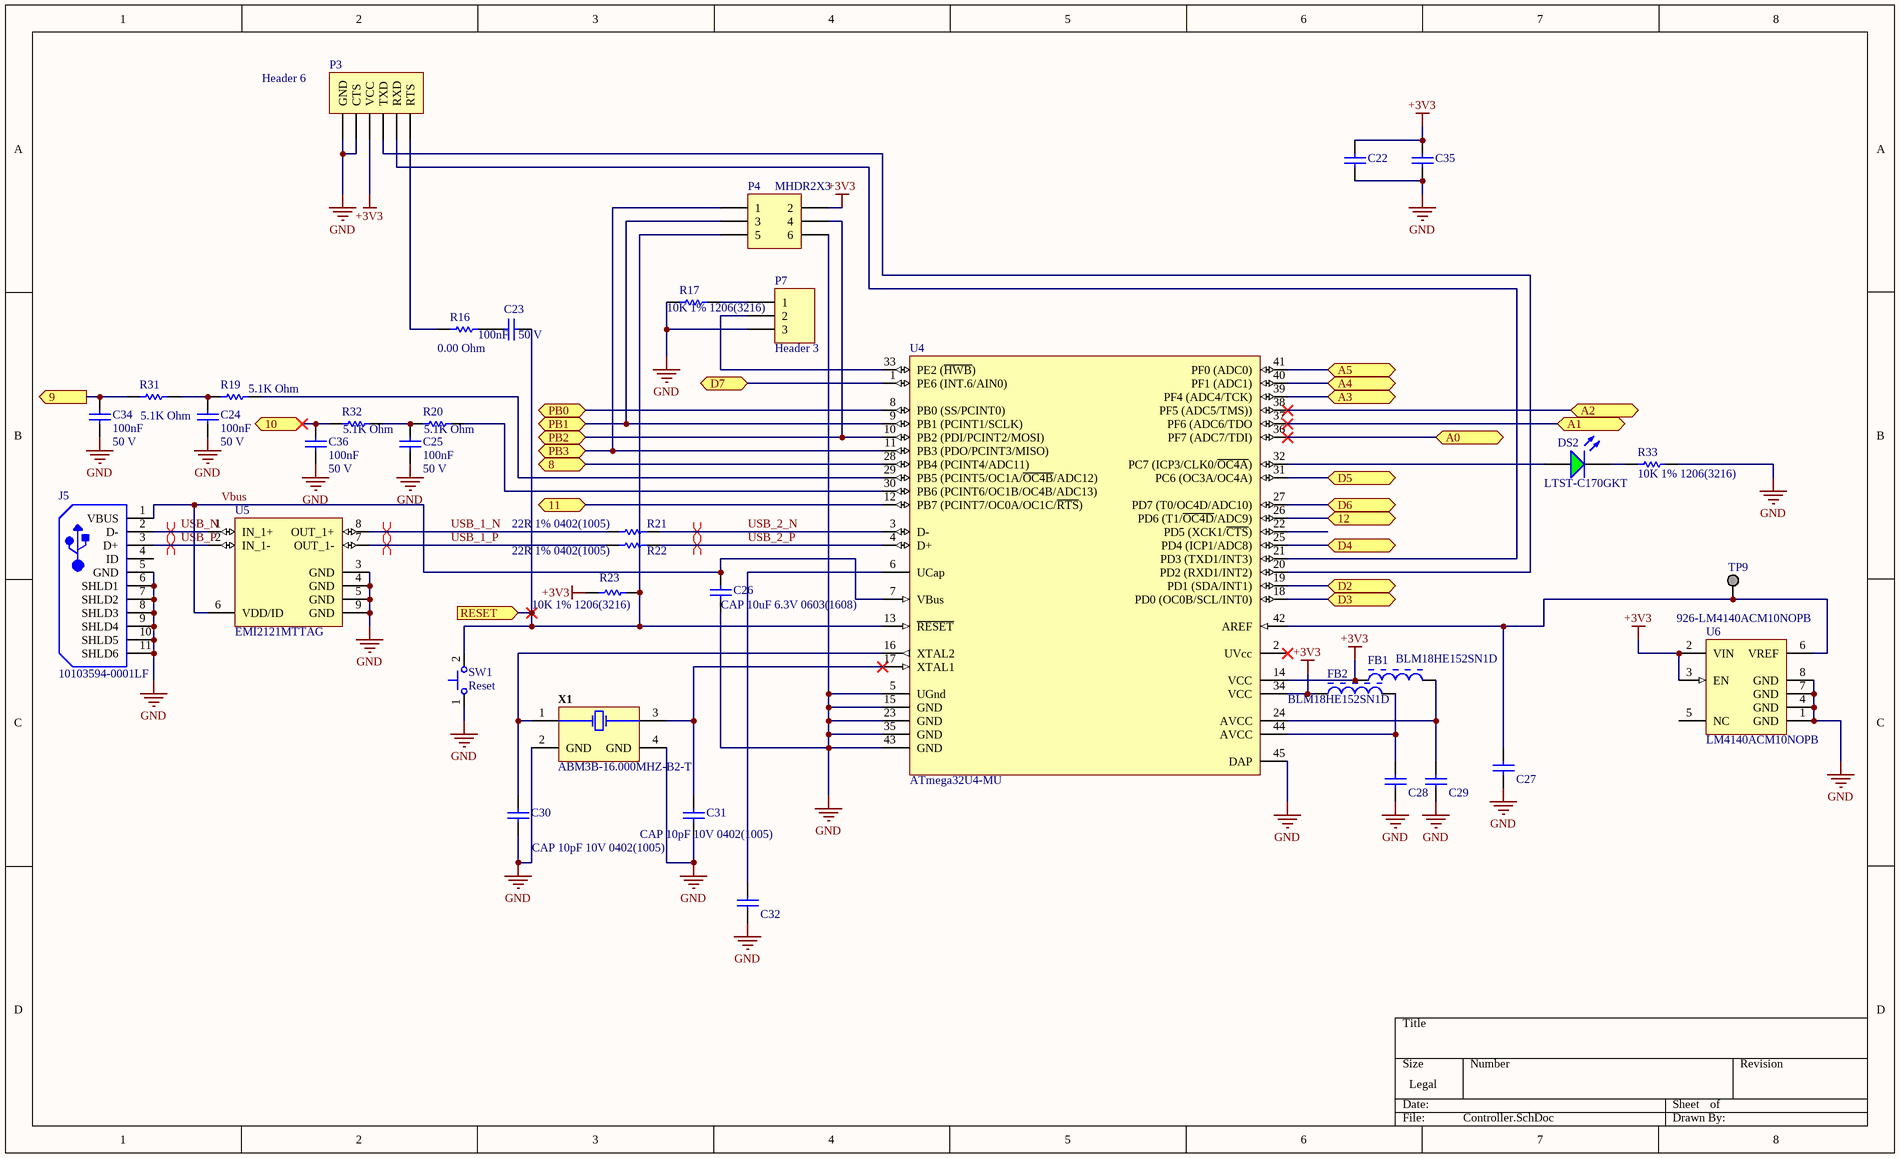
[diagram p2: Controller.SchDoc]

### Parts
C22  CAP 10uF 6.3V 0603(1608)  [CAPC0603(1608)100_L]  (value not drawn)
C23  value 100nF  Rated Voltage: 50 V  [CAPC1206(3216)100_N]  (hidden comment: CAP 100nF 50V 1206(3216))
C24  value 100nF  Rated Voltage: 50 V  [CAPC1206(3216)100_N]  (hidden comment: CAP 100nF 50V 1206(3216))
C25  value 100nF  Rated Voltage: 50 V  [CAPC1206(3216)100_N]  (hidden comment: CAP 100nF 50V 1206(3216))
C26  CAP 10uF 6.3V 0603(1608)  [CAPC0603(1608)100_L]
C27  CAP 1uF 25V 1206(3216)  [CAPC1206(3216)190_L]  (value not drawn)
C28  CAP 1uF 25V 1206(3216)  [CAPC1206(3216)190_L]  (value not drawn)
C29  CAP 1uF 25V 1206(3216)  [CAPC1206(3216)190_L]  (value not drawn)
C30  CAP 10pF 10V 0402(1005)  [CAPC0402(1005)60_L]
C31  CAP 10pF 10V 0402(1005)  [CAPC0402(1005)60_L]
C32  CAP 1uF 25V 1206(3216)  [CAPC1206(3216)190_L]  (value not drawn)
C34  value 100nF  Rated Voltage: 50 V  [CAPC1206(3216)100_N]  (hidden comment: CAP 100nF 50V 1206(3216))
C35  CAP 10uF 6.3V 0603(1608)  [CAPC0603(1608)100_L]  (value not drawn)
C36  value 100nF  Rated Voltage: 50 V  [CAPC1206(3216)100_N]  (hidden comment: CAP 100nF 50V 1206(3216))
DS2  LTST-C170GKT  [LTST-C170GKT_V]
FB1  BLM18HE152SN1D  [MURA-BLM18-RF-H4-CHIP-2_V]
FB2  BLM18HE152SN1D  [MURA-BLM18-RF-H4-CHIP-2_V]
J5  10103594-0001LF  [FCI-10103594-0001LF_V]
P3  Header 6  [HDR1X6]
P4  MHDR2X3  [MHDR2X3]
P7  Header 3  [HDR1X3]
R16  value 0.00 Ohm  [RESC1206(3216)_L]  (hidden comment: Jumper 1206(3216))
R17  10K 1% 1206(3216)  [RESC1206(3216)_L]
R19  value 5.1K Ohm  [RESC1206(3216)_L]  (hidden comment: 5K1 1% 1206(3216))
R20  value 5.1K Ohm  [RESC1206(3216)_L]  (hidden comment: 5K1 1% 1206(3216))
R21  22R 1% 0402(1005)  [RESC0402(1005)_L]
R22  22R 1% 0402(1005)  [RESC0402(1005)_L]
R23  10K 1% 1206(3216)  [RESC1206(3216)_L]
R31  value 5.1K Ohm  [RESC1206(3216)_L]  (hidden comment: 5K1 1% 1206(3216))
R32  value 5.1K Ohm  [RESC1206(3216)_L]  (hidden comment: 5K1 1% 1206(3216))
R33  10K 1% 1206(3216)  [RESC1206(3216)_L]
SW1  Reset  [JNFU-TVAF06_V]
TP9  ARef  [KSTN-1502-2]  (value not drawn)
U4  ATmega32U4-MU  [44PW_M]
U5  EMI2121MTTAG  [ONSC-WDFN-8-511BN_V]
U6  LM4140ACM10NOPB  Supplier Part Number 1: 926-LM4140ACM10NOPB  [D0008A_N]
X1  ABM3B-16.000MHZ-B2-T  [ABRA-ABM3B_V]

### Ports
8 (bidir), 9 (out), 10 (bidir), 11 (bidir), 12 (bidir), A0 (bidir), A1 (bidir), A2 (bidir), A3 (bidir), A4 (bidir), A5 (bidir), D2 (bidir), D3 (bidir), D4 (bidir), D5 (bidir), D6 (bidir), D7 (bidir), PB0 (bidir), PB1 (bidir), PB2 (bidir), PB3 (bidir), RESET (in)

### Nets
+3V3: C22.2 C35.2 FB1.1 FB2.1 P3.3(VCC) P4.2 R23.2 U4.14(VCC) U4.34(VCC) U6.2(VIN) U6.3(EN)
GND: C22.1 C24.2 C25.2 C26.1 C27.1 C28.1 C29.1 C30.1 C31.1 C32.1 C34.2 C35.1 C36.2 J5.5(GND) J5.6(SHLD1) J5.7(SHLD2) J5.8(SHLD3) J5.9(SHLD4) J5.10(SHLD5) J5.11(SHLD6) P3.1(GND) P3.2(CTS) P4.6 P7.3 R17.1 R33.2 SW1.1 U4.5(UGnd) U4.15(GND) U4.23(GND) U4.35(GND) U4.43(GND) U4.45(DAP) U5.3(GND) U5.4(GND) U5.5(GND) U5.9(GND) U6.1(GND) U6.4(GND) U6.7(GND) U6.8(GND) X1.2(GND) X1.4(GND)
8: U4.28(PB4_(PCINT4/ADC11)) ; port 8
9: C34.1 R31.1 ; port 9
10: C36.1 R32.1 ; port 10
11: U4.12(PB7_(PCINT7/OC0A/OC1C/~{RTS})) ; port 11
12: U4.26(PD6_(T1/~{OC4D}/ADC9)) ; port 12
A0: U4.36(PF7_(ADC7/TDI)) ; port A0
A1: U4.37(PF6_(ADC6/TDO) ; port A1
A2: U4.38(PF5_(ADC5/TMS))) ; port A2
A3: U4.39(PF4_(ADC4/TCK)) ; port A3
A4: U4.40(PF1_(ADC1)) ; port A4
A5: U4.41(PF0_(ADC0)) ; port A5
CS: U4.31(PC6_(OC3A/OC4A)) ; port D5
D2: U4.19(PD1_(SDA/INT1)) ; port D2
D3: U4.18(PD0_(OC0B/SCL/INT0)) ; port D3
D4: U4.25(PD4_(ICP1/ADC8)) ; port D4
D6: U4.27(PD7_(T0/OC4D/ADC10)) ; port D6
D7: U4.1(PE6_(INT.6/AIN0)) ; port D7
MISO: P4.1 U4.11(PB3_(PDO/PCINT3/MISO)) ; port PB3
MOSI: P4.4 U4.10(PB2_(PDI/PCINT2/MOSI)) ; port PB2
PB0: U4.8(PB0_(SS/PCINT0)) ; port PB0
PB1: P4.3 U4.9(PB1_(PCINT1/SCLK)) ; port PB1
RESET: C23.2 P4.5 R23.1 SW1.2 U4.13(~{RESET}) ; port RESET
USB_1_N: R21.1 U5.8(OUT_1+)
USB_1_P: R22.1 U5.7(OUT_1-)
USB_2_N: R21.2 U4.3(D-)
USB_2_P: R22.2 U4.4(D+)
USB_N: J5.2(D-) U5.1(IN_1+)
USB_P: J5.3(D+) U5.2(IN_1-)
Vbus: C26.2 J5.1(VBUS) U4.7(VBus) U5.6(VDD/ID)
NetC23_1: C23.1 R16.2
NetC24_1: C24.1 R19.1 R31.2
NetC25_1: C25.1 R20.1 R32.2
NetC27_2: C27.2 TP9.1 U4.42(AREF) U6.6(VREF)
NetC28_2: C28.2 FB2.2 U4.44(AVCC)
NetC29_2: C29.2 FB1.2 U4.24(AVCC)
NetC30_2: C30.2 U4.16(XTAL2) X1.1(X1)
NetC31_2: C31.2 U4.17(XTAL1) X1.3(X2)
NetC32_2: C32.2 U4.6(UCap)
NetDS2_1: DS2.1(A) U4.32(PC7_(ICP3/CLK0/~{OC4A}))
NetDS2_2: DS2.2(K) R33.1
NetP3_4: P3.4(TXD) U4.20(PD2_(RXD1/INT2))
NetP3_5: P3.5(RXD) U4.21(PD3_(TXD1/INT3))
NetP3_6: P3.6(RTS) R16.1
NetP7_1: P7.1 R17.2
NetP7_2: P7.2 U4.33(PE2_(~{HWB}))
NetR19_2: R19.2 U4.29(PB5_(PCINT5/OC1A/~{OC4B}/ADC12))
NetR20_2: R20.2 U4.30(PB6_(PCINT6/OC1B/OC4B/ADC13))

Not connected (* = marked no-connect by the designer): J5 4(ID); U4 2(UVcc)* 22(PD5_(XCK1/~{CTS})); U6 5(NC)

### Layout directives
differential pair: USB_1_N, USB_1_P, USB_2_N, USB_2_P, USB_N, USB_P

### Library data of the parts
C22 C26 C35 = CMP-1035-02796-1: CAP 10uF 6.3V ±10% 0603 (1608 Metric) Thickness 1mm SMD; Case-EIA: 0603; Case-Metric: 1608; Tolerance: ±10%; Value: 10uF; Technology: SMT; Rated Voltage: 6.3 V; Max Thickness: 1 mm
C23-C25 C34 C36 = CMP-1037-04202-1: as C3 on sheet Serial Power Supply - Main; Technology: SMT; Max Thickness: 1 mm
C27-C29 C32 = CMP-1037-04699-1: CAP 1uF 25V ±5% 1206 (3216 Metric) Thickness 1.9mm SMD; Tolerance: Â±5%; Case-EIA: 1206; Case-Metric: 3216; Rated Voltage: 25 V; Max Thickness: 1.9 mm; Technology: SMT; Value: 1uF
C30 C31 = CMP-1034-00701-1: CAP 10pF 10V ±2% 0402 (1005 Metric) Thickness 0.6mm SMD; Case-Metric: 1005; Case-EIA: 0402; Rated Voltage: 10 V; Max Thickness: 0.6 mm; Tolerance: ±2%; Value: 10pF; Technology: SMT
DS2 = CMP-1674-00002-5: as DS1 on sheet Serial Power Supply - Main; ComponentLink1URL: http://www.us.liteon.com/; Height: 1.1 mm; PackageDescription: 2-Pin Surface Mount Device, Body 2 x 1.25 mm; RoHSCompliant: true; Package Quantity: 1; Packaging: Tape and Reel; Mount: Surface Mount; Min Operating Temperature: -55 degC; DatasheetVersion: 03/2003; Max Operating Temperature: 85 degC; ComponentLink1Description: Manufacturer URL; Pins: 2; Mounting Technology: Surface Mount; Length: 2 mm; Colour: Green; PackageReference: C170GKT; ComponentLink2URL: http://media.digikey.com/pdf/Data%20Sheets/Lite-On%20PDFs/LTST-C170GKT.pdf; ComponentLink2Description: Datasheet
FB1 FB2 = CMP-0686-00368-2: Chip Ferrite Bead for GHz Band High-speed Signal Lines, 1500 Ohm, 500 mA, -55 to 125 degC, 1.6 x 0.8 x 0.95 mm SMD, Tape and Reel; Manufacturer: Murata; Rated Current: 500 mA; Impedance (at 100 MHz): 1500 Ohm +/- 25%; DC Resistance: 0.50 Ohm Max.; Packing: Tape and Reel; DatasheetVersion: 08/2013; ComponentLink1URL: http://www.murata.com/; Mounting Technology: Surface Mount; ComponentLink2URL: http://www.murata.com/products/catalog/pdf/c31e.pdf; ComponentLink3Description: Package Specification; ComponentLink2Description: Datasheet; PackageReference: BLM18_H950-2; ComponentLink1Description: Manufacturer URL; PackageDescription: 2-Pin Chip, Body 1.6 x 0.8 mm; ComponentLink3URL: http://www.murata.com/products/catalog/pdf/c31e.pdf; PartNumber: BLM18HE152SN1D; Operating Temperature Range: -55 to 125 degC
J5 = CMP-1698-00007-1: Micro USB 2.0 B Receptacle, -55 to 85 degC, 5-Pin SMD, RoHS, Tape and Reel; Type (Resistor): Thick Film; Case\Package: 0603; Resistance: 4.7 kohm; Tolerance: 1%; Voltage Rating: 75 V; Power Rating: 100 mW; Case Code (Imperial): 0603; Case Code (Metric): 1608; REACH SVHC: Unknown; ComponentLink1URL: http://portal.fciconnect.com/; Package Quantity: 5000; RoHSCompliant: true; Max Operating Temperature: 155 degC; Min Operating Temperature: -55 degC; Mount: Surface Mount; Weight: 7.1E-05 oz; Length: 1.55 mm; PackageDescription: 5-Pin Surface Mount Device, Body 8.04 x 5.62 mm; Pins: 2; Height: 0.45 mm; ComponentLink2Description: Datasheet; ComponentLink2URL: http://portal.fciconnect.com/Comergent//fci/drawing/10103594.pdf; PackageReference: FCI-10103594-0001LF; DatasheetVersion: Rev. A, 06/2010; Width: 0.85 mm; Packaging: Tape and Reel; ComponentLink1Description: Manufacturer URL
P3 = Header 6: Header, 6-Pin; LatestRevisionDate: 17-Jul-2002; LatestRevisionNote: Re-released for DXP Platform.; Publisher: Altium Limited
P4 = MHDR2X3: Header, 3-Pin, Dual row; LatestRevisionDate: 17-Jul-2002; LatestRevisionNote: Re-released for DXP Platform.; Publisher: Altium Limited
P7 = Header 3: Header, 3-Pin; LatestRevisionDate: 17-Jul-2002; LatestRevisionNote: Re-released for DXP Platform.; Publisher: Altium Limited
R16 = CMP-1014-00001-1: Jumper 1206 (3216 Metric); Tolerance: None; Case-EIA: 1206; Case-Metric: 3216; Populate: 0; Technology: SMT; Power: None
R17 R23 R33 = CMP-1014-00623-1: as R13 on sheet Serial Power Supply - Main; Power: 0.25 W; Technology: SMT; Tolerance: 1 %
R19 R20 R31 R32 = CMP-1014-00590-1: 5K1 0.25W 1% 1206 (3216 Metric)  SMD; Case-EIA: 1206; Case-Metric: 3216; Power: 0.25 W; Technology: SMT; Tolerance: 1 %
R21 R22 = CMP-1011-00320-1: 22R 0.063W 1% 0402 (1005 Metric)  SMD; Case-EIA: 0402; Case-Metric: 1005; Value: 22.00 Ohm; Tolerance: 1 %; Technology: SMT; Power: 0.063 W
SW1 = CMP-0587-00001-2: Switch, SPST Push Button, 50 mA, 12 V DC, SMD, -30 to 85 degC, RoHS; Manufacturer: Jianfu; PartNumber: TVAF06; Contact Resistance: 100 mW max; Lifetime: 100000 Cycles min; Rating: 50 mA. 12 V DC; Insulation Resistance: 100 MW min. 100 V DC; Travel: 0.13 +/- 0.05 mm; Dielectric Strength: 250 V AC for 1 min; RoHS: TRUE; Mounting Technology: Surface Mount; PackageDescription: 2-Pin Switch, Push Button, SMD, Body 2.9 x 3.9 mm; ComponentLink1Description: Manufacturer URL; ComponentLink1URL: http://www.jian-fu.com/; Operating Temperature: -30 to 85 degC; ComponentLink2URL: http://en.jian-fu.com/product-22.html; PackageReference: TVAF06; ComponentLink2Description: Datasheet
TP9 = CMP-1672-00001-4: Terminal DBL Turret, Through Hole, RoHS; Contact Finish: Tin; Lead Pitch: 0.218 inch; PackageReference: 1502-2; Mount: Through Hole; Pins: 50; DatasheetVersion: Rev. A, 02/2008; RoHSCompliant: true; REACH SVHC: No SVHC; Contact Material: Brass; Length: 2.77 mm; PackageDescription: 1-Pin Through Hole Device, Dia 3.18 mm; Package Quantity: 1; Mounting Technology: Through Hole; Supplier 1: Mouser; Supplier Part Number 1: 575-2501200800000
U4 = CMP-0095-00166-2: 8-bit AVR Microcontroller, 2.7-5.5V, 16MHz, 32KB Flash, 1KB EEPROM, 2.5KB SRAM, USB Controller, 44-pin QFN, Industrial Grade (-40°C to 85°C), Ext Osc; PackageVersion: revG, Sep-2009; PackageReference: 44PW; ComponentLink1URL: http://www.atmel.com/; PackageDescription: 44-Pin Quad Flat No-Lead Package, 7 x 7 mm Body, 0.5 mm Pitch (QFN); ComponentLink3Description: ATmega16U4 ATmega32U4 Summary; RevisionNote: DatasheetVersion, PackageVersion & PCB updated. URLs added.; ComponentLink2Description: ATmega16U4/32U4 Datasheet; ComponentLink1Description: Manufacturer URL; ComponentLink3URL: http://www.atmel.com/dyn/resources/prod_documents/7766S.pdf; DatasheetVersion: revF, Nov-2010; ComponentLink2URL: http://www.atmel.com/dyn/resources/prod_documents/doc7766.pdf; Code_JEDEC: MO-220-VKKD-1
U5 = CMP-1066-00065-1: Single Pair Common Mode Filter with ESD Protection, -40 to 85 degC, 8-Pin WDFN, Pb-Free, Tape and Reel; Manufacturer: On Semiconductor; C Typ (pF): 0.8; Number of Lines: 3; VRWM Max (V): 5; ComponentLink2Description: Datasheet; PackageReference: WDFN-8-511BN; RoHS: Pb-Free; ComponentLink1Description: Manufacturer URL; PartNumber: EMI2121MTTAG; DatasheetVersion: Rev. 2; PackageVersion: Rev. A, 12/2012; PackageDescription: 8-Pin Small Outline No-Lead, Body 2.2 x 2 mm, Pitch 0.5 mm; Mounting Technology: Surface Mount; ComponentLink1URL: http://www.onsemi.com/; ComponentLink2URL: http://www.onsemi.com/pub_link/Collateral/EMI2121MT-D.PDF; Packing: Tape and Reel; ComponentLink3Description: Package Specification; ComponentLink3URL: http://www.onsemi.com/pub_link/Collateral/511BN.PDF
U6 = CMP-0074-00330-3: Precision Micropower Low Dropout Voltage Reference, 8-pin Narrow SOIC; Manufacturer: Texas Instruments; CompType: Voltage Reference IC; PowerWise: Y; PackageTopMarking: NSZXTT*4140A*CM2.0; ComponentLink1URL: http://www.ti.com/general/docs/lit/getliterature.tsp?genericPartNumber=LM4140&fileType=pdf; ComponentLink1Description: Datasheet; RevisionNote: Component URLs added; DatasheetVersion: Feb-2005; PinCount: 8; Code_JEDEC: MS-012-AA; RoHS: N; PackageDescription: SOIC Narrow, 4.9 x 3.9 x 1.45mm, 8 Lead, 1.27mm Pitch; Code_IPC: SOIC127P600-8; PackageReference: D0008A; PackageVersion: revM, May-2009; Supplier 1: Mouser
X1 = CMP-1688-00002-1: Ceramic SMD Crystal, 8 MHz, +/- 20 ppm, 200 Ohm, -20 to 70 degC, 4-Pin SMD, RoHS, Tape and Reel; Max Supply Voltage: 45 V; Outputs: 4; Min Supply Voltage: 8.2 V; Output Voltage: 3.3 V; Switching Frequency: 30 KHz; Output Current: 1.8 A; Packaging: Rail/Tube; ComponentLink2Description: Datasheet; REACH SVHC: No SVHC; ComponentLink1URL: http://www.abracon.com/; PackageReference: ABM3B; Weight: 0.004233 oz; Height: 1.05 mm; ComponentLink2URL: http://www.abracon.com/Resonators/abm3b.pdf; Mount: Surface Mount; Min Operating Temperature: -40 degC; Max Operating Temperature: 85 degC; Package Quantity: 50; PackageDescription: 4-Pin Surface Mount Device, Body 5 x 3.2 mm; Pins: 28; DatasheetVersion: Aug-15; ComponentLink1Description: Manufacturer URL; RoHSCompliant: true; Radiation Hardening: No; Length: 9.8 mm; Width: 4.5 mm

## Sheet Current Regulator.SchDoc
size Letter
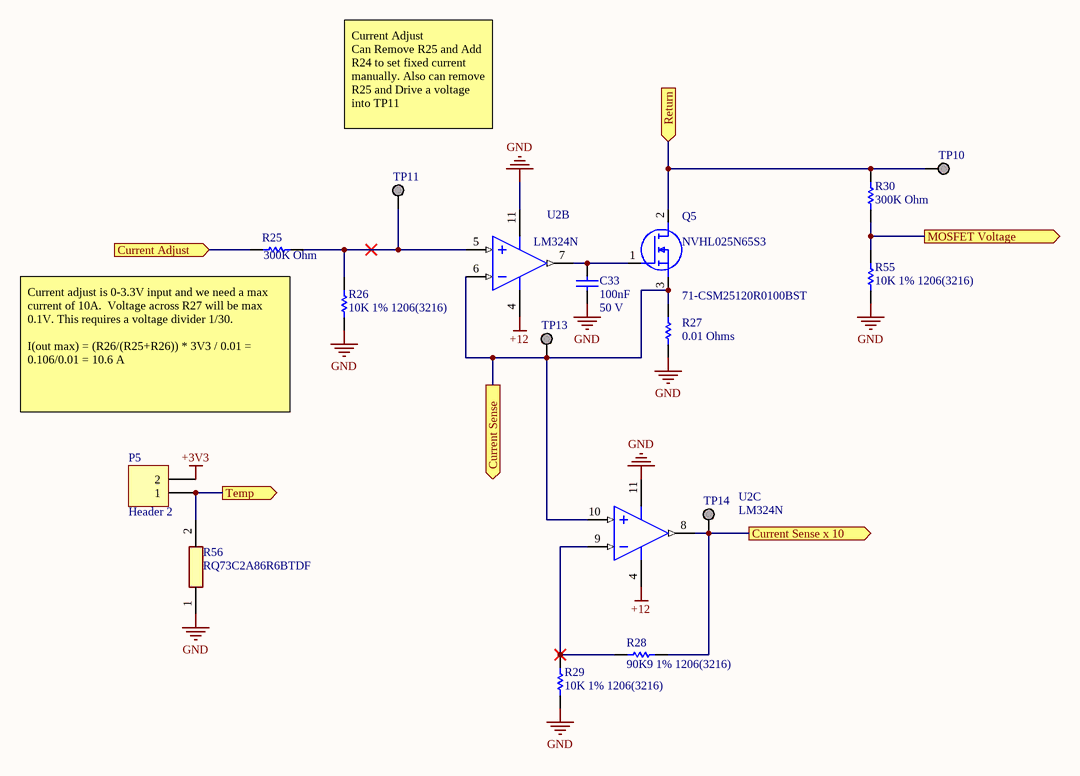
[diagram p3: Current Regulator.SchDoc]

### Parts
C33  value 100nF  Rated Voltage: 50 V  [CAPC1206(3216)100_N]  (hidden comment: CAP 100nF 50V 1206(3216))
P5  Header 2  [HDR1X2]
Q5  NVHL025N65S3  [TO556P482X1562X2475-3P]
R25  value 300K Ohm  [RESC1206(3216)_L]  (hidden comment: 300K 1% 1206(3216))
R26  10K 1% 1206(3216)  [RESC1206(3216)_L]
R27  value 0.01 Ohms  Supplier Part Number 1: 71-CSM25120R0100BST  [RESC2512(6432)_L]  (hidden comment: 0.01Ohms 1% 2512(6432))
R28  90K9 1% 1206(3216)  [RESC1206(3216)_L]
R29  10K 1% 1206(3216)  [RESC1206(3216)_L]
R30  value 300K Ohm  [RESC1206(3216)_L]  (hidden comment: 300K 1% 1206(3216))
R55  10K 1% 1206(3216)  [RESC1206(3216)_L]
R56  RQ73C2A86R6BTDF  [RESC2012X65N]
TP10  Return  [KSTN-1502-2]  (value not drawn)
TP11  Current Adjust  [KSTN-1502-2]  (value not drawn)
TP13  CS  [KSTN-1502-2]  (value not drawn)
TP14  CS 10x  [KSTN-1502-2]  (value not drawn)
U2  LM324N  [N14A]  (parts B,C of 4)

### Ports
Current Adjust (in), Current Sense (out), Current Sense x 10 (out), MOSFET Voltage (out), Return (in), Temp (out)

### Nets
+3V3: P5.2
+12: U2.4(V+)
GND: C33.2 R26.1 R27.1 R29.1 R55.1 R56.1 U2.11(GND)
9: R25.1 ; port Current Adjust
A1: Q5.3(S) R27.2 TP13.1 U2.6(IN2-) U2.10(IN3+) ; port Current Sense
A2: R28.2 TP14.1 U2.8(OUT3) ; port Current Sense x 10
A3: R30.1 R55.2 ; port MOSFET Voltage
A5: P5.1 R56.2 ; port Temp
Return: Q5.2(D) R30.2 TP10.1 ; port Return
NetC33_1: C33.1 Q5.1(G) U2.7(OUT2)
NetR25_2: R25.2 R26.2 TP11.1 U2.5(IN2+)
NetR28_1: R28.1 R29.2 U2.9(IN3-)

### Notes on the sheet
- Current Adjust
  Can Remove R25 and Add R24 to set fixed current manually. Also can remove R25 and Drive a voltage into TP11
- (near R25) Current adjust is 0-3.3V input and we need a max current of 10A.  Voltage across R27 will be max 0.1V. This requires a voltage divider 1/30.
  I(out max) = (R26/(R25+R26)) * 3V3 / 0.01 = 0.106/0.01 = 10.6 A

### Library data of the parts
C33 = CMP-1037-04202-1: as C3 on sheet Serial Power Supply - Main; Technology: SMT; Max Thickness: 1 mm
P5 = Header 2: Header, 2-Pin; LatestRevisionDate: 17-Jul-2002; LatestRevisionNote: Re-released for DXP Platform.; Publisher: Altium Limited
Q5 = NVHL025N65S3: MOSFET (N-Channel); Manufacturer_Name: ON Semiconductor; Datasheet Link: https://www.onsemi.com/pub/Collateral/NVHL025N65S3-D.PDF; Height: 4.82mm; Manufacturer_Part_Number: NVHL025N65S3; Mouser Part Number: 863-NVHL025N65S3; Mouser Price/Stock: https://www.mouser.com/Search/Refine.aspx?Keyword=863-NVHL025N65S3
R25 R30 = CMP-1014-00788-1: 300K 0.25W 1% 1206 (3216 Metric)  SMD; Case-EIA: 1206; Case-Metric: 3216; Technology: SMT; Tolerance: 1 %; Power: 0.25 W
R26 R55 = CMP-1014-00623-1: 10K 0.25W 1% 1206 (3216 Metric)  SMD; Case-Metric: 3216; Value: 10000.00 Ohm; Case-EIA: 1206; Populate: 0; Power: 0.25 W; Technology: SMT; Tolerance: 1 %
R27 = CMP-1018-00510-1: Case-EIA: 2512; Case-Metric: 6432; Power: 1 W; Technology: SMT; Tolerance: 1 %; Supplier 1: Mouser
R28 = CMP-1014-00731-1: 90K9 0.25W 1% 1206 (3216 Metric)  SMD; Case-Metric: 3216; Case-EIA: 1206; Value: 90900.00 Ohm; Tolerance: 1 %; Power: 0.25 W; Technology: SMT
R29 = CMP-1014-00623-1: as R13 on sheet Serial Power Supply - Main; Power: 0.25 W; Technology: SMT; Tolerance: 1 %
R56 = RQ73C2A86R6BTDF: Resistor; Manufacturer_Name: TE Connectivity; Datasheet Link: https://componentsearchengine.com/Datasheets/1/RQ73C2A86R6BTDF.pdf; Height: 0.65mm; Manufacturer_Part_Number: RQ73C2A86R6BTDF; Arrow Part Number: RQ73C2A86R6BTDF; Mouser Part Number: 279-RQ73C2A86R6BTDF; Mouser Price/Stock: https://www.mouser.com/Search/Refine.aspx?Keyword=279-RQ73C2A86R6BTDF
TP10 = CMP-1672-00001-4: Contact Finish: Tin; Lead Pitch: 0.218 inch; PackageReference: 1502-2; Mount: Through Hole; Pins: 50; DatasheetVersion: Rev. A, 02/2008; RoHSCompliant: true; REACH SVHC: No SVHC; Contact Material: Brass; Length: 2.77 mm; PackageDescription: 1-Pin Through Hole Device, Dia 3.18 mm; Package Quantity: 1; Mounting Technology: Through Hole; Supplier 1: Mouser; Supplier Part Number 1: 575-2501200800000
TP11 TP13 TP14 = CMP-1672-00001-4: Terminal DBL Turret, Through Hole, RoHS; Contact Finish: Tin; Lead Pitch: 0.218 inch; PackageReference: 1502-2; Mount: Through Hole; Pins: 50; DatasheetVersion: Rev. A, 02/2008; RoHSCompliant: true; REACH SVHC: No SVHC; Contact Material: Brass; Length: 2.77 mm; PackageDescription: 1-Pin Through Hole Device, Dia 3.18 mm; Package Quantity: 1; Mounting Technology: Through Hole; Supplier 1: Mouser; Supplier Part Number 1: 575-2501200800000
U2 = CMP-0055-00082-1: as U2 on sheet Serial Power Supply - Main; PinCount: 14; PackageVersion: revG, May-2006; PackageReference: N14A; Code_JEDEC: MS-001-AA; PackageDescription: MDIP, .750 x .250 x.130in, 14 Lead, .100in Pitch; RoHS: N; DatasheetVersion: Aug-2000

## Sheet Mechanical.SchDoc
size Letter
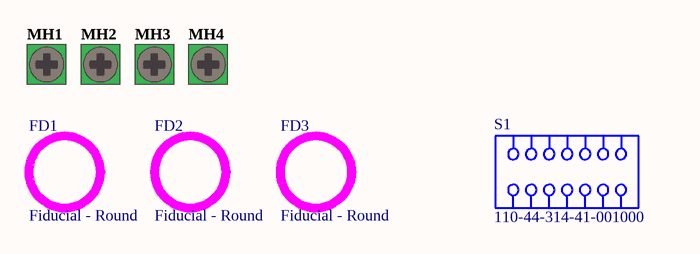
[diagram p4: Mechanical.SchDoc]

### Parts
FD1  Fiducial - Round  [FID150X450]  (no BOM)
FD2  Fiducial - Round  [FID150X450]  (no BOM)
FD3  Fiducial - Round  [FID150X450]  (no BOM)
MH1  Mounting-Hole-Screw  [MTG_M2_PV]  (value not drawn)  (no BOM)
MH2  Mounting-Hole-Screw  [MTG_M2_PV]  (value not drawn)  (no BOM)
MH3  Mounting-Hole-Screw  [MTG_M2_PV]  (value not drawn)  (no BOM)
MH4  Mounting-Hole-Screw  [MTG_M2_PV]  (value not drawn)  (no BOM)
S1  110-44-314-41-001000  (mechanical)

### Nets

Not connected (* = marked no-connect by the designer): MH1 1; MH2 1; MH3 1; MH4 1

### Library data of the parts
FD1-FD3 = Fiducial
MH1-MH4 = Mounting-Hole-Screw: Mounting Hole, Screw
S1 = SC-2P-F-R20: 110 Series Standard Solder Tail Open Frame Dual In-Line Socket - DIP-14